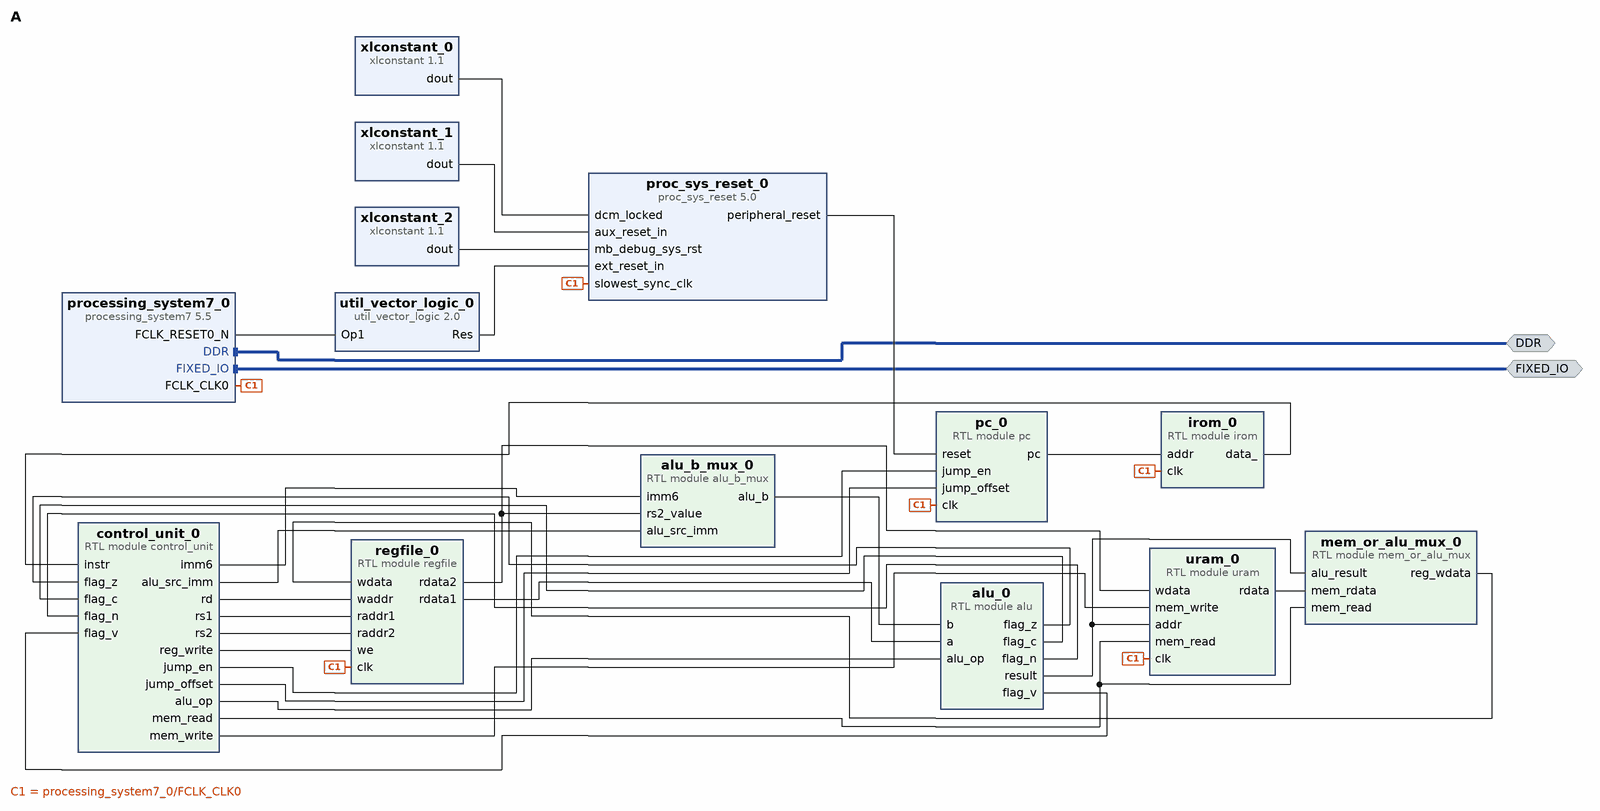
[diagram p0: block diagram of the top level]
# Vivado block design A, xc7z010clg225-2, Vivado 2019.1
create_bd_design A

create_bd_intf_port -mode Master -vlnv xilinx.com:interface:ddrx_rtl:1.0 DDR
create_bd_intf_port -mode Master -vlnv xilinx.com:display_processing_system7:fixedio_rtl:1.0 FIXED_IO

create_bd_cell -type module -reference pc pc_0
create_bd_cell -type module -reference regfile regfile_0
create_bd_cell -type ip -vlnv xilinx.com:ip:processing_system7:5.5 processing_system7_0
set_property -dict {CONFIG.PCW_FPGA0_PERIPHERAL_FREQMHZ 25 CONFIG.PCW_USE_M_AXI_GP0 0} [get_bd_cells processing_system7_0]
# 30 more settings of processing_system7_0 are not shown: defaults, MIO pin electricals, DDR timing, and values the tool derives
create_bd_cell -type ip -vlnv xilinx.com:ip:proc_sys_reset:5.0 proc_sys_reset_0
set_property -dict {CONFIG.C_AUX_RESET_HIGH 0} [get_bd_cells proc_sys_reset_0]
create_bd_cell -type ip -vlnv xilinx.com:ip:xlconstant:1.1 xlconstant_0
create_bd_cell -type ip -vlnv xilinx.com:ip:xlconstant:1.1 xlconstant_1
set_property -dict {CONFIG.CONST_VAL 0} [get_bd_cells xlconstant_1]
create_bd_cell -type ip -vlnv xilinx.com:ip:xlconstant:1.1 xlconstant_2
set_property -dict {CONFIG.CONST_VAL 0} [get_bd_cells xlconstant_2]
create_bd_cell -type ip -vlnv xilinx.com:ip:util_vector_logic:2.0 util_vector_logic_0
set_property -dict {CONFIG.C_OPERATION not CONFIG.C_SIZE 1} [get_bd_cells util_vector_logic_0]
create_bd_cell -type module -reference irom irom_0
set_property -dict {CONFIG.MEM_FILE program.mem} [get_bd_cells irom_0]
create_bd_cell -type module -reference alu_b_mux alu_b_mux_0
create_bd_cell -type module -reference mem_or_alu_mux mem_or_alu_mux_0
create_bd_cell -type module -reference uram uram_0
create_bd_cell -type module -reference control_unit control_unit_0
create_bd_cell -type module -reference alu alu_0

# ---- connections ----

connect_bd_intf_net [get_bd_intf_ports FIXED_IO] [get_bd_intf_pins processing_system7_0/FIXED_IO]
connect_bd_intf_net [get_bd_intf_ports DDR] [get_bd_intf_pins processing_system7_0/DDR]
connect_bd_net [get_bd_pins processing_system7_0/FCLK_CLK0] \
  [get_bd_pins pc_0/clk] [get_bd_pins regfile_0/clk] [get_bd_pins proc_sys_reset_0/slowest_sync_clk] [get_bd_pins irom_0/clk] \
  [get_bd_pins uram_0/clk]
connect_bd_net [get_bd_pins proc_sys_reset_0/peripheral_reset] [get_bd_pins pc_0/reset]
connect_bd_net [get_bd_pins xlconstant_0/dout] [get_bd_pins proc_sys_reset_0/dcm_locked]
connect_bd_net [get_bd_pins xlconstant_1/dout] [get_bd_pins proc_sys_reset_0/aux_reset_in]
connect_bd_net [get_bd_pins xlconstant_2/dout] [get_bd_pins proc_sys_reset_0/mb_debug_sys_rst]
connect_bd_net [get_bd_pins util_vector_logic_0/Res] [get_bd_pins proc_sys_reset_0/ext_reset_in]
connect_bd_net [get_bd_pins pc_0/pc] [get_bd_pins irom_0/addr]
connect_bd_net [get_bd_pins regfile_0/rdata1] [get_bd_pins alu_0/a]
connect_bd_net [get_bd_pins control_unit_0/rd] [get_bd_pins regfile_0/waddr]
connect_bd_net [get_bd_pins control_unit_0/rs1] [get_bd_pins regfile_0/raddr1]
connect_bd_net [get_bd_pins control_unit_0/rs2] [get_bd_pins regfile_0/raddr2]
connect_bd_net [get_bd_pins irom_0/data_] [get_bd_pins control_unit_0/instr]
connect_bd_net [get_bd_pins control_unit_0/reg_write] [get_bd_pins regfile_0/we]
connect_bd_net [get_bd_pins control_unit_0/alu_op] [get_bd_pins alu_0/alu_op]
connect_bd_net [get_bd_pins processing_system7_0/FCLK_RESET0_N] [get_bd_pins util_vector_logic_0/Op1]
connect_bd_net [get_bd_pins control_unit_0/imm6] [get_bd_pins alu_b_mux_0/imm6]
connect_bd_net [get_bd_pins control_unit_0/alu_src_imm] [get_bd_pins alu_b_mux_0/alu_src_imm]
connect_bd_net [get_bd_pins alu_b_mux_0/alu_b] [get_bd_pins alu_0/b]
connect_bd_net [get_bd_pins control_unit_0/mem_read] [get_bd_pins uram_0/mem_read] [get_bd_pins mem_or_alu_mux_0/mem_read]
connect_bd_net [get_bd_pins control_unit_0/mem_write] [get_bd_pins uram_0/mem_write]
connect_bd_net [get_bd_pins control_unit_0/jump_en] [get_bd_pins pc_0/jump_en]
connect_bd_net [get_bd_pins control_unit_0/jump_offset] [get_bd_pins pc_0/jump_offset]
connect_bd_net [get_bd_pins mem_or_alu_mux_0/reg_wdata] [get_bd_pins regfile_0/wdata]
connect_bd_net [get_bd_pins uram_0/rdata] [get_bd_pins mem_or_alu_mux_0/mem_rdata]
connect_bd_net [get_bd_pins alu_0/result] [get_bd_pins uram_0/addr] [get_bd_pins mem_or_alu_mux_0/alu_result]
connect_bd_net [get_bd_pins regfile_0/rdata2] [get_bd_pins uram_0/wdata] [get_bd_pins alu_b_mux_0/rs2_value]
connect_bd_net [get_bd_pins alu_0/flag_z] [get_bd_pins control_unit_0/flag_z]
connect_bd_net [get_bd_pins alu_0/flag_c] [get_bd_pins control_unit_0/flag_c]
connect_bd_net [get_bd_pins alu_0/flag_n] [get_bd_pins control_unit_0/flag_n]
connect_bd_net [get_bd_pins alu_0/flag_v] [get_bd_pins control_unit_0/flag_v]

validate_bd_design
save_bd_design
